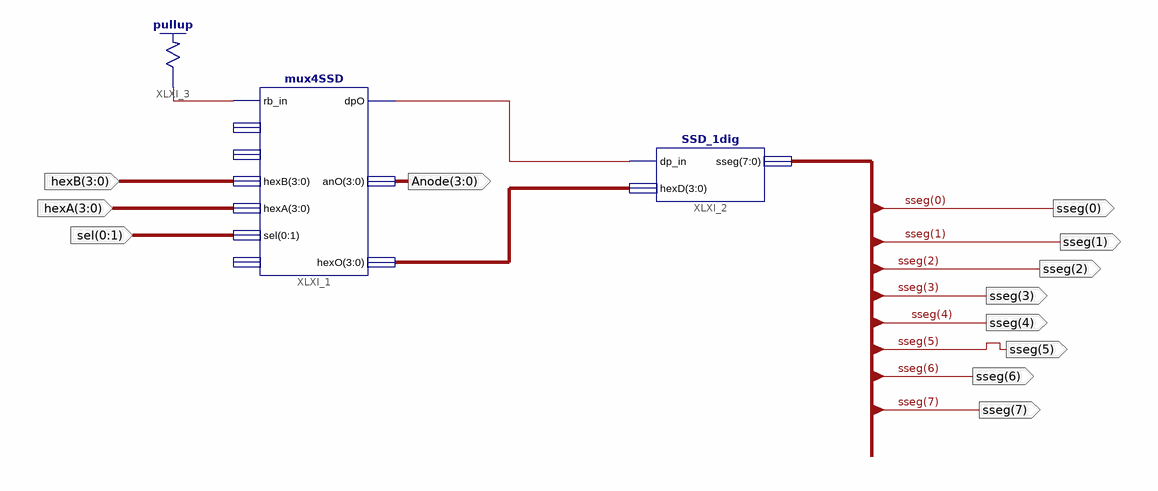
[diagram p0: schematic sheet 1]
// Xilinx ISE schematic Exp2.sch (spartan3e) as structural Verilog: 3 symbols, 12 ports
module Exp2 (
  input  [0:1] sel,
  input  [3:0] hexA,
  input  [3:0] hexB,
  output [3:0] Anode,
  output [7:0] sseg
);

  wire XLXN_5, XLXN_8;
  wire [3:0] XLXN_7;

  mux4SSD XLXI_1 (
    .rb_in(XLXN_5), .hexB(hexB), .hexA(hexA), .sel(sel), .dpO(XLXN_8), .anO(Anode), .hexO(XLXN_7));  // open: hexD, hexC, dp_in
  SSD_1dig XLXI_2 (.dp_in(XLXN_8), .hexD(XLXN_7), .sseg(sseg));
  \pullup  XLXI_3 (.O(XLXN_5));
endmodule
